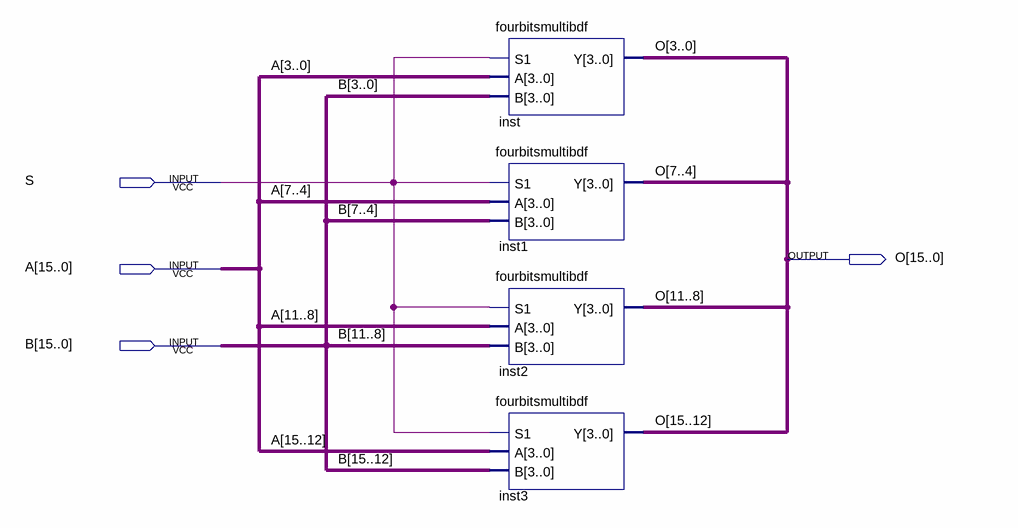
[diagram p0: schematic sheet]
// Quartus schematic onesix.bdf as structural Verilog: 4 symbols, 4 pins
module onesix (
  input  S,
  input  [15:0] A,
  input  [15:0] B,
  output [15:0] O
);

  fourbitsmultibdf inst (.S1(S), .A(A[3:0]), .B(B[3:0]), .Y(O[3:0]));
  fourbitsmultibdf inst1 (.S1(S), .A(A[7:4]), .B(B[7:4]), .Y(O[7:4]));
  fourbitsmultibdf inst2 (.S1(S), .A(A[11:8]), .B(B[11:8]), .Y(O[11:8]));
  fourbitsmultibdf inst3 (.S1(S), .A(A[15:12]), .B(B[15:12]), .Y(O[15:12]));
endmodule
